# Altium schematic sheet adaptateur.SchDoc
size A4
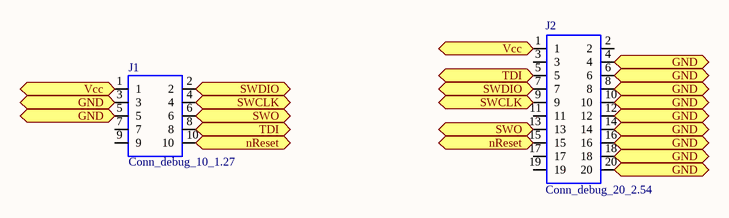
[diagram p0: adaptateur.SchDoc]

## Parts
J1  Conn_debug_10_1.27  [FTSH-105-01-F-DV-K]
J2  Conn_debug_20_2.54  [PCBComponent_1]

## Ports
GND, nReset, SWCLK, SWDIO, SWO, TDI, Vcc

## Nets
GND: J1.3 J1.5 J2.4 J2.6 J2.8 J2.10 J2.12 J2.14 J2.16 J2.18 J2.20 ; port GND
nReset: J1.10 J2.15 ; port nReset
SWCLK: J1.4 J2.9 ; port SWCLK
SWDIO: J1.2 J2.7 ; port SWDIO
SWO: J1.6 J2.13 ; port SWO
TDI: J1.8 J2.5 ; port TDI
Vcc: J1.1 J2.1 ; port Vcc

Not connected (* = marked no-connect by the designer): J1 7 9; J2 2 3 11 17 19

## Notes on the sheet
- Title
- Size:
- Date:
- A4
- Author:
- Time:
- Revision:
- Sheet
- of
- File: